# EAGLE design czujniki (EAGLE 7.7.0)
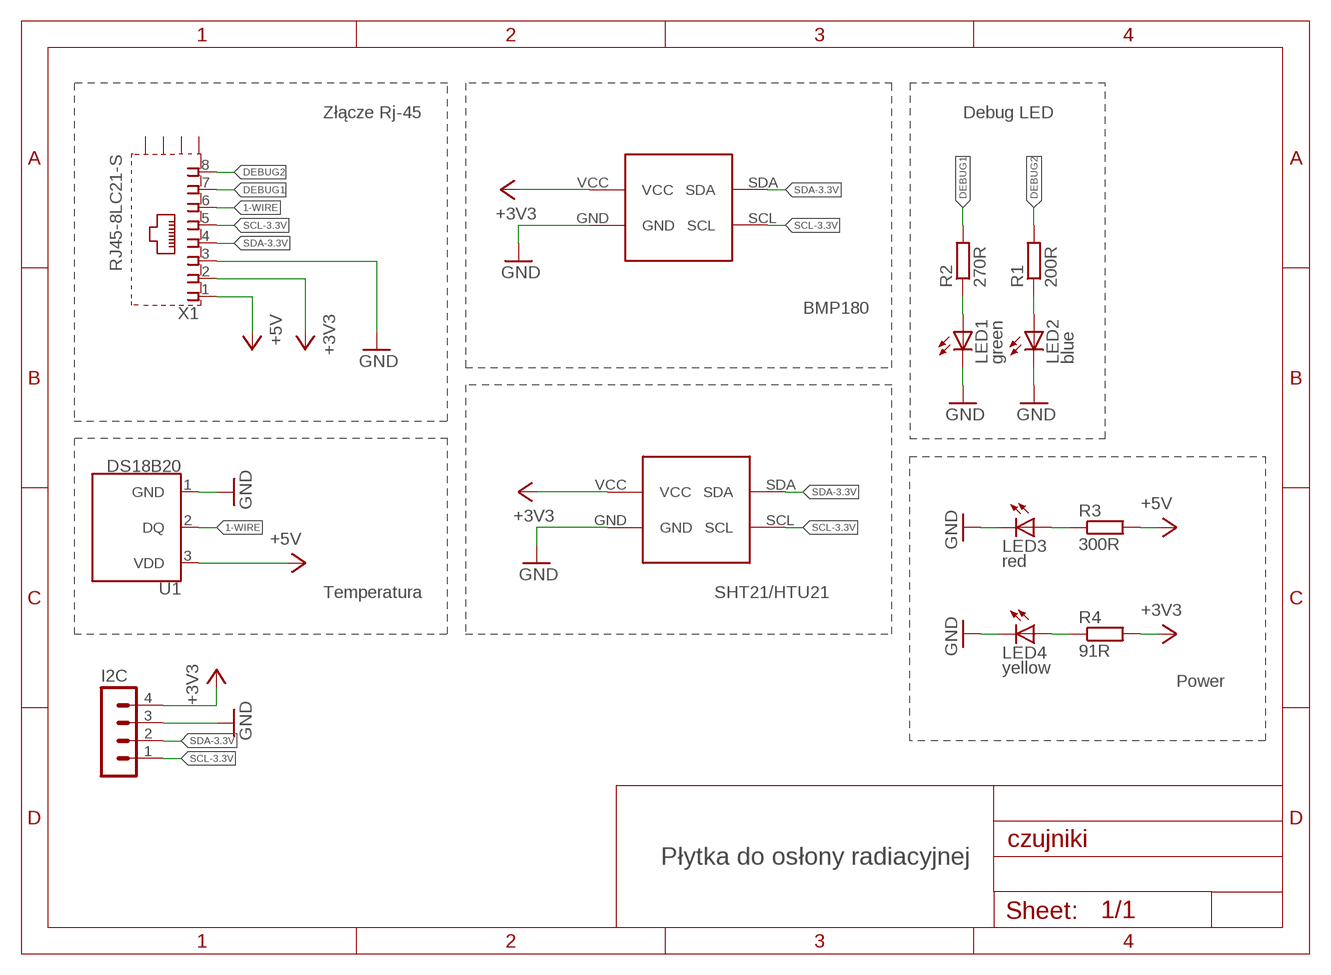
[diagram p0: schematic, sheet 1]

## Parts
I2C  MA04-1  [MA04-1]
LED1  green  LEDCHIPLED_1206  [CHIPLED_1206]
LED2  blue  LEDCHIPLED_1206  [CHIPLED_1206]
LED3  red  LEDCHIPLED_1206  [CHIPLED_1206]
LED4  yellow  LEDCHIPLED_1206  [CHIPLED_1206]
R1  200R  R-EU_M0805  [M0805]
R2  270R  R-EU_M0805  [M0805]
R3  300R  R-EU_M0805  [M0805]
R4  91R  R-EU_M0805  [M0805]
U1  DS18B20  [TO-92-AMMO]
U$1  BMP180  [BMP180]
U$2  I2C_BOARD  [I2C_BOARD]
X1  RJ45-8LC21-S  [RJ45-SHIELD1]

## Nets
1-WIRE: U1.2(DQ) X1.6
+3V3: I2C.4 R4.2 U$1.VCC U$2.VCC X1.2
+5V: R3.2 U1.3(VDD) X1.1
DEBUG1: R2.2 X1.7
DEBUG2: R1.2 X1.8
GND: I2C.3 LED1.C LED2.C LED3.C LED4.C U1.1(GND) U$1.GND U$2.GND X1.3
N$1: LED1.A R2.1
N$2: LED2.A R1.1
N$3: LED3.A R3.1
N$5: LED4.A R4.1
SCL-3.3V: I2C.1 U$1.SCL U$2.SCL X1.5
SDA-3.3V: I2C.2 U$1.SDA U$2.SDA X1.4
Unconnected: X1.S1(S) X1.S2(S) X1.S3(S) X1.S4(S)

## Notes on the sheet
- Złącze Rj-45 | Debug LED
- BMP180
- Temperatura | SHT21/HTU21
- Power
- Płytka do osłony radiacyjnej

## Library data of the parts
I2C = con-lstb:MA04-1: PIN HEADER; OC_FARNELL: unknown; OC_NEWARK: unknown
LED1-LED4 = adafruit:LED: LED OSRAM: - CHIPLED LG R971, LG N971, LY N971, LG Q971, LY Q971, LO R971, LY R971 LH N974, LH R974 LS Q976, LO Q976, LY Q976 LO Q996 - Hyper CHIPLED LW Q18S LB Q993, LB Q99A, LB R99A - SideLED LS A670, LO A670, LY A670, LG A670, LP A670 LB A673, LV A673, LT A673, LW A673 LH A674 LY A675 LS A676, LA A676, LO A676, LY A676, LW A676 LS A679, LY A679, LG A679 - Hyper Micro SIDELED® LS Y876, LA Y876, LO Y876, LY Y876 LT Y87S - SmartLED LW L88C, LW L88S LB L89C, LB L89S, LG L890 LS L89K, LO L89K, LY L89K LS L896, LA L896, LO L896, LY L896 - TOPLED LS T670, LO T670, LY T670, LG T670, LP T670 LSG T670, LSP T670, LSY T670, LOP T670, LYG T670 LG T671, LOG T671, LSG T671 LB T673, LV T673, LT T673, LW T673 LH T674 LS T676, LA T676, LO T676, LY T676, LB T676, LH T676, LSB T676, LW T676 LB T67C, LV T67C, LT T67C, LS T67K, LO T67K, LY T67K, LW E67C LS E67B, LA E67B, LO E67B, LY E67B, LB E67C, LV E67C, LT E67C LW T67C LS T679, LY T679, LG T679 LS T770, LO T770, LY T770, LG T770, LP T770 LB T773, LV T773, LT T773, LW T773 LH T774 LS E675, LA E675, LY E675, LS T675 LS T776, LA T776, LO T776, LY T776, LB T776 LHGB T686 LT T68C, LB T68C - Hyper Mini TOPLED® LB M676 - Mini TOPLED Santana® LG M470 LS M47K, LO M47K, LY M47K Source: http://www.osram.convergy.de/
R1-R4 = rcl:R-EU_: RESISTOR, European symbol
U1 = SparkFun-Sensors:DS18B20: Dallas/Maxim DS18B20 1-Wire Temperature Sensor The DS18B20 reports degrees C with 9 to 12-bit precision, -55C to 125C (+/-0.5C). Each sensor has a unique 64-Bit Serial number etched into it - allows for a huge number of sensors to be used on one data bus. Datasheet <http://datasheets.maximintegrated.com/en/ds/DS18B20.pdf> SparkFun Products One Wire Digital Temperature Sensor - DS18B20 <https://www.sparkfun.com/products/245> (SEN-00245); STORE_ID: SEN-00245
U$1 = boards:BMP180
U$2 = boards2:I2C_BOARD
X1 = con-tycoelectronics:RJ45*2: RJ45 Low Profile Shield Type 2 For all RJ45 L, LC, LCT and X Series Models Source: www.tycoelectronics.com .. ENG_DS_1654001_1099_RJ_L_0507.pdf; OC_FARNELL: unknown; OC_NEWARK: unknown

## Board
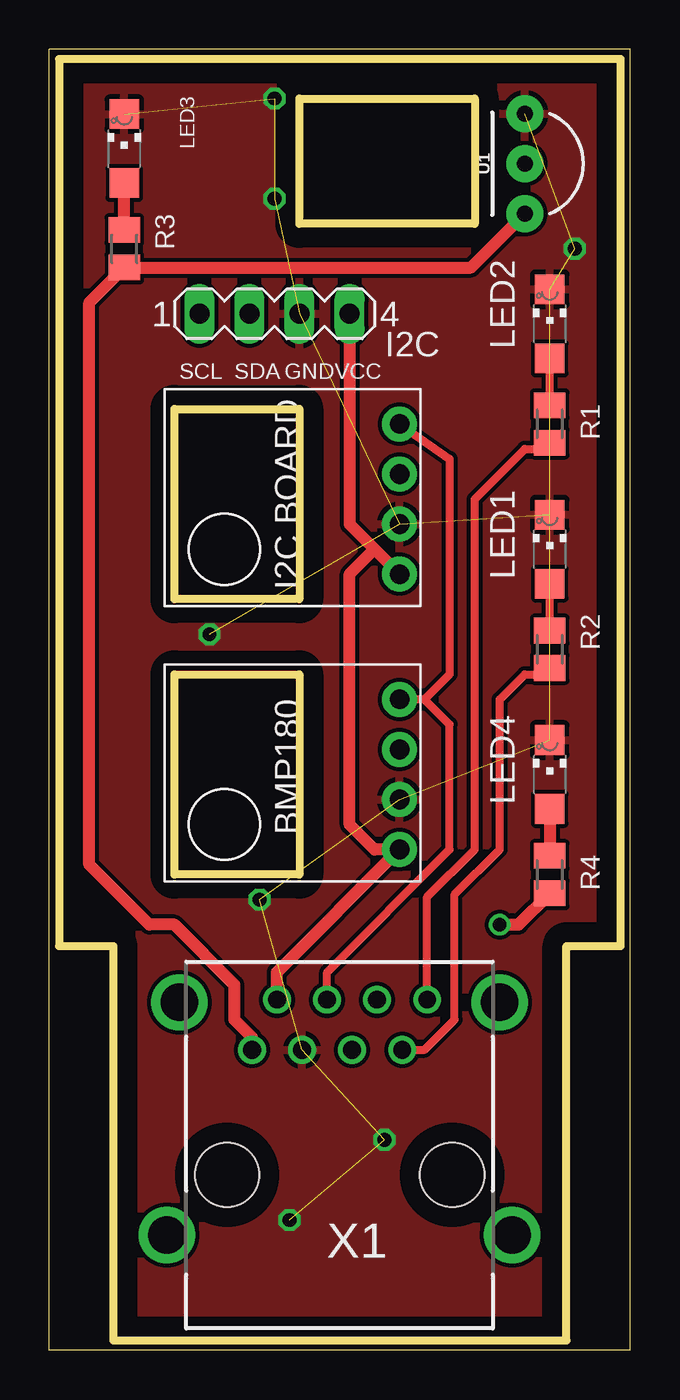
[diagram p1: board, top side]
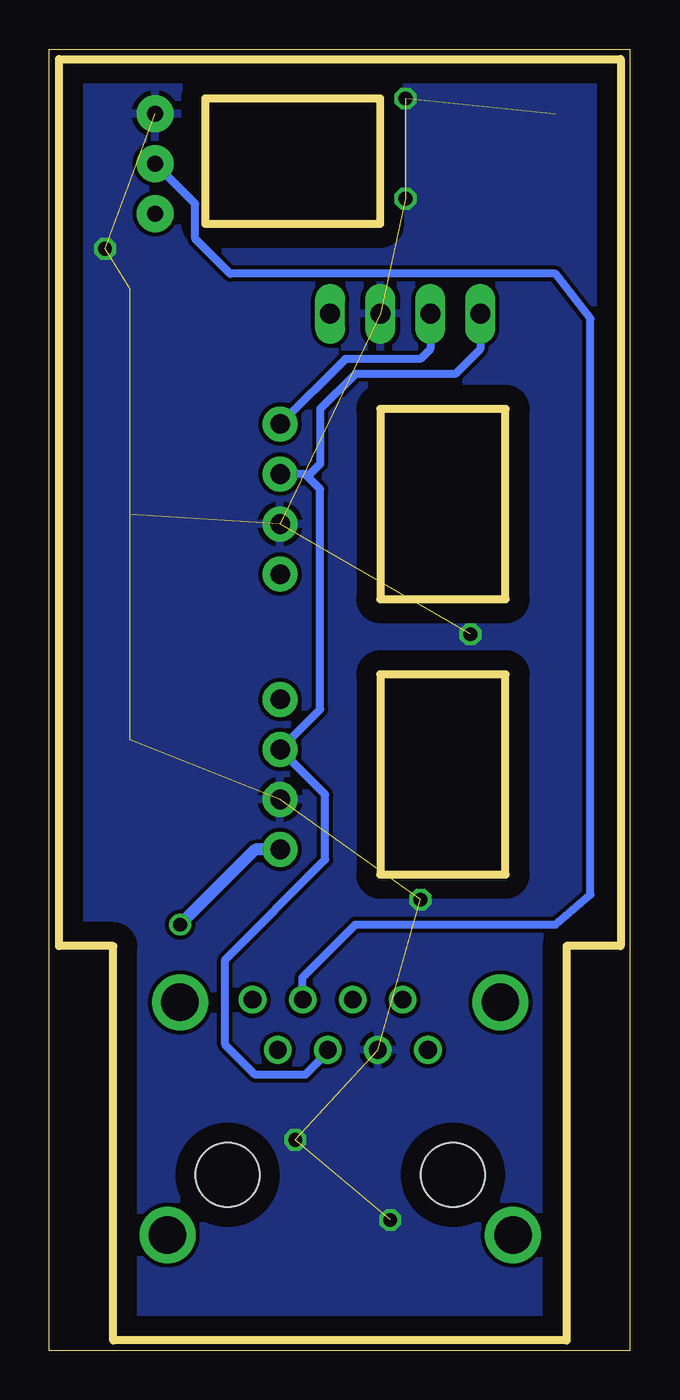
[diagram p2: board, bottom side, seen from below]

Size 29.5 x 66 mm. Coordinates in mm from the lower left corner, seen from the top.
Outline: 29.5,0 29.5,66 0,66 0,0 29.5,0
Outline: 3.25,0.5 26.25,0.5 26.25,20.5 29,20.5 29,65.5 0.5,65.5 0.5,20.5 3.25,20.5 3.25,0.5
Outline: 6.35,34.29 12.7,34.29 12.7,24.13 6.35,24.13 6.35,34.29
Outline: 6.35,38.1 6.35,47.75 12.7,47.75 12.7,38.1 6.35,38.1
Outline: 12.7,57.15 12.7,63.5 21.59,63.5 21.59,57.15 12.7,57.15
Copper layers (1*16): Top 0.035mm / dielectric 1.5mm / Bottom 0.035mm
Design rules "default": minimum track width 10mil, minimum drill 24mil, track to track 8mil, track to pad 8mil, pad to pad 8mil, via to via 8mil, smd to smd 8mil, copper to edge 40mil, drill to drill 8mil, minimum pad ring 10mil, minimum via ring 8mil, stop-mask expansion 4mil, vias tented up to drill 0mil, thermal gap 10mil

### Footprints (pad centres in the part's own frame; a part is rotated, then mirrored left to right if it is on the bottom)
MA04-1 = drill 1.016 long: 1 -3.81,0; 2 -1.27,0; 3 1.27,0; 4 3.81,0
CHIPLED_1206 = smd 1.5 x 1.5: A 0,-1.75; C 0,1.75
M0805 = smd 1.3 x 1.6: 1 -0.95,0; 2 0.95,0
TO-92-AMMO = drill 0.813 pad 1.88: 1 -2.54,0; 2 0,0; 3 2.54,0
BMP180 = drill 1 pad 1.778: GND 1.27,5.08; SCL -1.27,5.08; SDA -3.81,5.08; VCC 3.81,5.08
I2C_BOARD = drill 1 pad 1.778: GND 1.27,5.08; SCL -1.27,5.08; SDA -3.81,5.08; VCC 3.81,5.08
RJ45-SHIELD1 = drill 0.9 pad 1.4: 1 -4.445,6.35; 2 -3.175,8.89; 3 -1.905,6.35; 4 -0.635,8.89; 5 0.635,6.35; 6 1.905,8.89; 7 3.175,6.35; 8 4.445,8.89 | drill 1.9 pad 2.5: S1 -8.763,-3.048; S2 8.763,-3.048; S3 -8.128,8.76; S4 8.128,8.76 | hole 3.251: -5.715,0; 5.715,0

### Placement (x,y rotation side)
I2C  11.43,52.58 0 top
LED1  25.4,40.64 0 top
LED2  25.4,52.07 0 top
LED3  3.81,60.96 0 top
LED4  25.4,29.21 0 top
R1  25.4,46.99 270 top
R2  25.4,35.56 270 top
R3  3.81,55.88 270 top
R4  25.4,24.13 270 top
U1  24.13,60.2 270 top
U$1  12.7,29.21 270 top
U$2  12.7,43.18 270 top
X1  14.73,8.89 0 top

### Tracks (layer width: path | path; a pad name or v marks a point on that pad's centre or on a via)
1-WIRE
  Bottom 0.406: X1.6 16.64,18.92 13.97,21.59 3.81,21.59 2.03,23.11 2.03,52.32 3.81,54.61 20.32,54.61 22.1,56.39 22.1,58.17 U1.2
+3V3  (via drill 0.7)
  Top 0.61: X1.2 11.56,19.18 U$1.VCC 16.51,25.4 15.24,26.67 15.24,39.37 16.51,40.64 | 16.51,40.64 U$2.VCC | R4.2 23.81,21.59 v22.86,21.59 | I2C.4 15.24,41.91 16.51,40.64
  Bottom 0.61: U$1.VCC 19.05,25.4 v22.86,21.59
+5V
  Top 0.61: X1.1 10.29,15.88 9.4,16.76 9.4,18.54 6.35,21.59 5.08,21.59 2.03,24.64 2.03,53.15 R3.2 21.4,54.93 U1.3
DEBUG1
  Top 0.406: X1.7 19.05,15.24 20.57,16.76 20.57,23.11 22.86,25.4 22.86,33.02 24.13,34.29 25.08,34.29 R2.2
DEBUG2
  Top 0.406: X1.8 19.18,22.99 21.59,25.4 21.59,43.18 24.13,45.72 25.08,45.72 R1.2
GND  (via drill 0.7)  (15 unrouted)
  other vias: 11.43,63.5 11.43,58.42 26.67,55.88 8.13,36.32 10.67,22.86 12.19,6.6 17.02,10.67
  pour Bottom: 4.06,1.02 25.4,1.02 25.4,21.08 28.45,21.08 28.45,65.02 1.02,65.02 1.02,21.08 4.06,21.08
  pour Top: 4.06,1.02 25.4,1.02 25.4,21.08 28.45,21.08 28.45,64.77 1.02,64.77 1.02,21.08 4.06,21.08
N$1
  Top 0.406: R2.1 LED1.A
N$2
  Top 0.406: R1.1 LED2.A
N$3
  Top 0.61: R3.1 LED3.A
N$5
  Top 0.61: LED4.A R4.1
SCL-3.3V
  Bottom 0.406: X1.5 15.37,15.11 16.51,13.97 19.05,13.97 20.57,15.49 20.57,19.81 15.49,24.89 15.49,28.19 U$1.SCL 15.75,32.51 15.75,43.69 16.38,44.32 | 16.38,44.32 16.51,44.45 U$2.SCL | I2C.1 7.62,50.8 8.89,49.53 13.97,49.53 15.75,47.75 15.75,44.96 16.38,44.32
SDA-3.3V
  Top 0.406: X1.4 14.1,19.18 20.32,25.4 20.32,31.75 19.05,33.02 | 19.05,33.02 U$1.SDA | U$2.SDA 20.32,45.21 20.32,34.29 19.05,33.02
  Bottom 0.406: I2C.2 10.16,50.8 10.67,50.29 14.48,50.29 U$2.SDA

### Text on the board
tNames: SCL | SDA | GND | VCC
tValues: Power 5V | Debug 2 | Debug 1 | Power 3.3V | Wachcio Meteo v 1.0 - III 2018